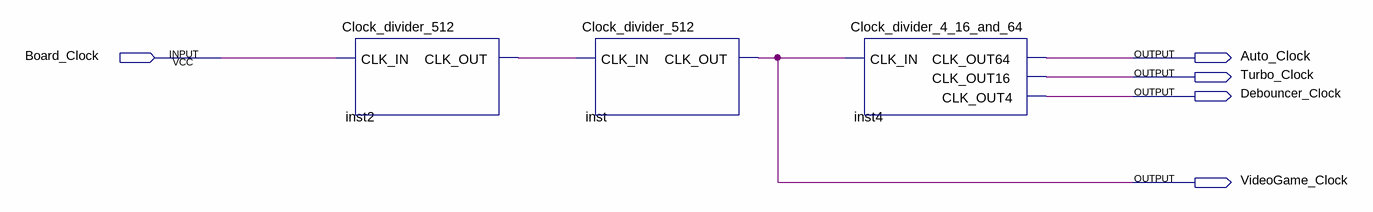
[diagram p0: schematic sheet]
// Quartus schematic Clock_dividers.bdf as structural Verilog: 3 symbols, 5 pins
module Clock_dividers (
  input  Board_Clock,
  output Auto_Clock,
  output Turbo_Clock,
  output Debouncer_Clock,
  output VideoGame_Clock
);

  wire inst2_clk_out;

  Clock_divider_512 inst2 (.CLK_IN(Board_Clock), .CLK_OUT(inst2_clk_out));
  Clock_divider_512 inst (.CLK_IN(inst2_clk_out), .CLK_OUT(VideoGame_Clock));
  Clock_divider_4_16_and_64 inst4 (
    .CLK_IN(VideoGame_Clock), .CLK_OUT64(Auto_Clock), .CLK_OUT16(Turbo_Clock), .CLK_OUT4(Debouncer_Clock));
endmodule
